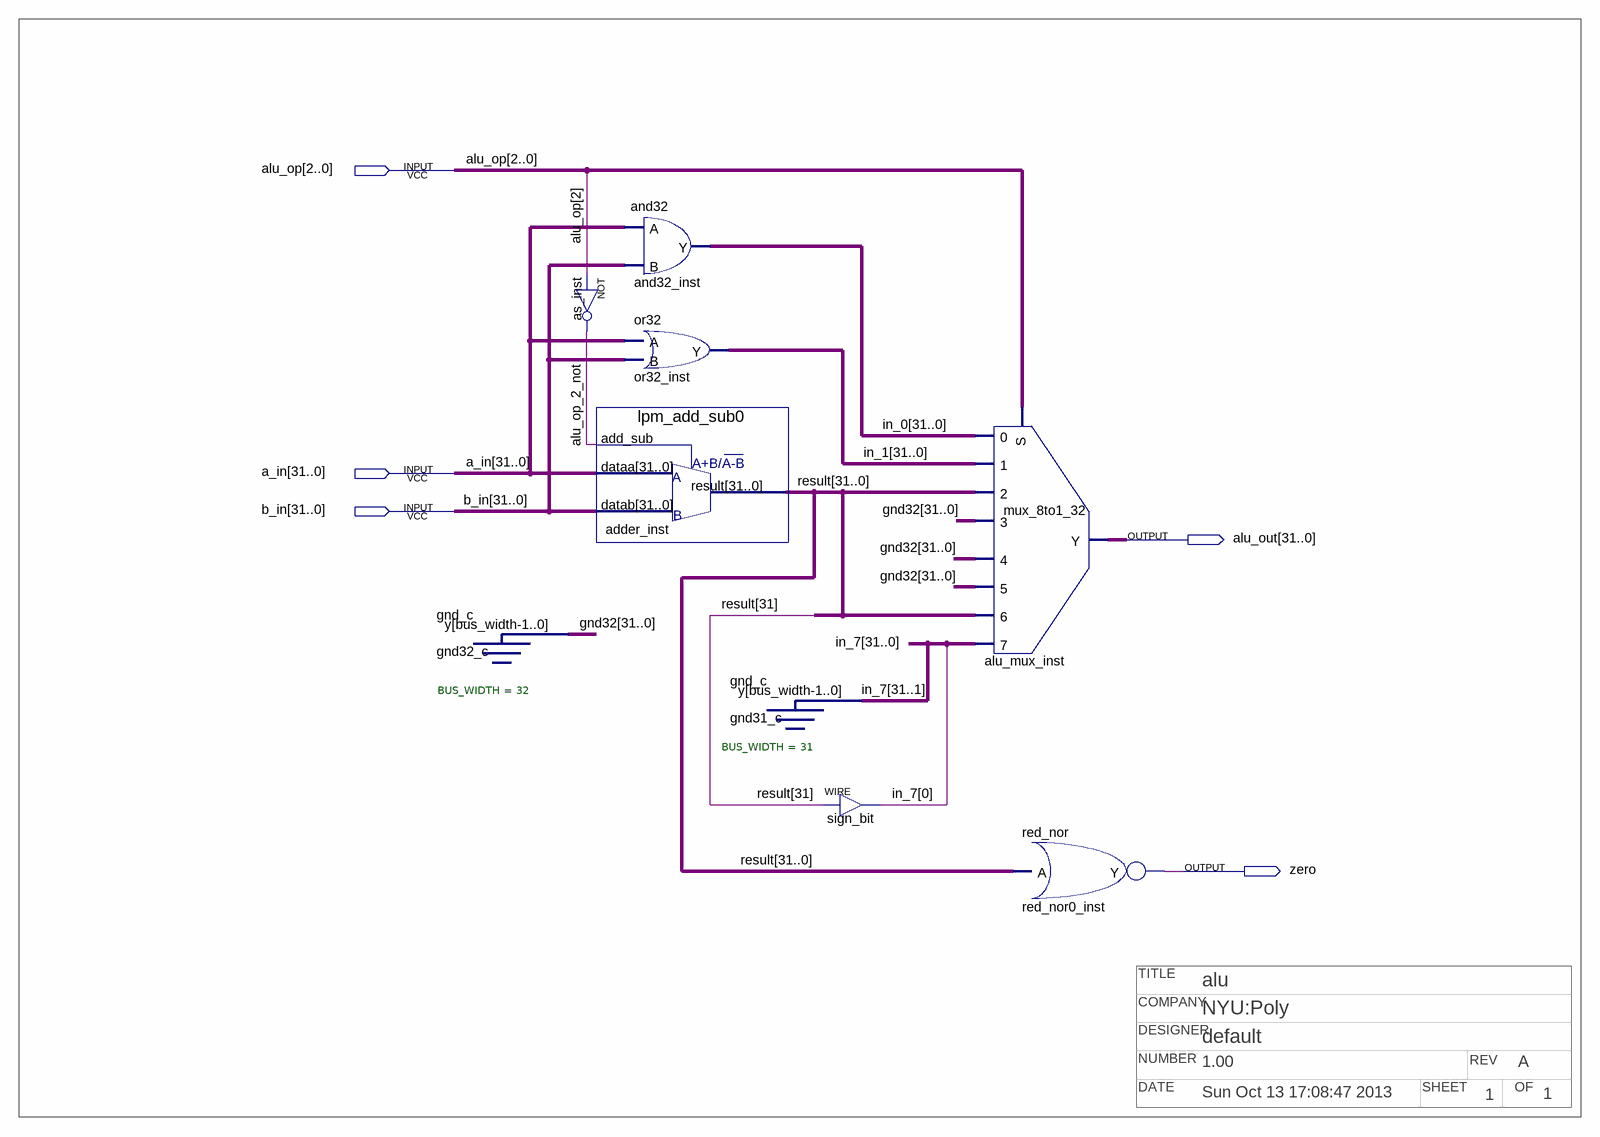
[diagram p0: schematic sheet]
// Quartus schematic alu.bdf as structural Verilog: 9 symbols, 5 pins
// Title block: COMPANY: NYU:Poly; DATE: Sun Oct 13 17:08:47 2013; DESIGNER: default; NUMBER: 1.00; OF: 1; REV: A; SHEET: 1; TITLE: alu
module alu (
  input  [2:0] alu_op,
  input  [31:0] a_in,
  input  [31:0] b_in,
  output [31:0] alu_out,
  output zero
);

  wire alu_op_2_not;
  wire [31:0] gnd32, in_0, in_1, in_7, result;

  gnd_c #(.BUS_WIDTH(32)) gnd32_c (.y(gnd32));
  and32 and32_inst (.a(a_in), .b(b_in), .y(in_0));
  not as_inst (alu_op_2_not, alu_op[2]);
  or32 or32_inst (.a(a_in), .b(b_in), .y(in_1));
  lpm_add_sub0 adder_inst (.add_sub(alu_op_2_not), .dataa(a_in), .datab(b_in), .result(result));
  gnd_c #(.BUS_WIDTH(31)) gnd31_c (.y(in_7[31:1]));
  assign in_7[0] = result[31];  // WIRE sign_bit
  mux_8to1_32 alu_mux_inst (
    .in_0(in_0), .in_1(in_1), .in_2(result), .in_3(gnd32), .in_4(gnd32), .in_5(gnd32), .in_6(result),
    .in_7(in_7), .sel_input(alu_op), .out_bus(alu_out));
  red_nor red_nor0_inst (.a_in(result), .y_out(zero));
endmodule
